# EasyEDA schematic SCH_Auto-Sensor-Home-Light_2025-07-21.json
TITLE: Sheet_1; REV: 1.0; Date: 2025-07-18; Sheet: 1/1; Company: Your Company
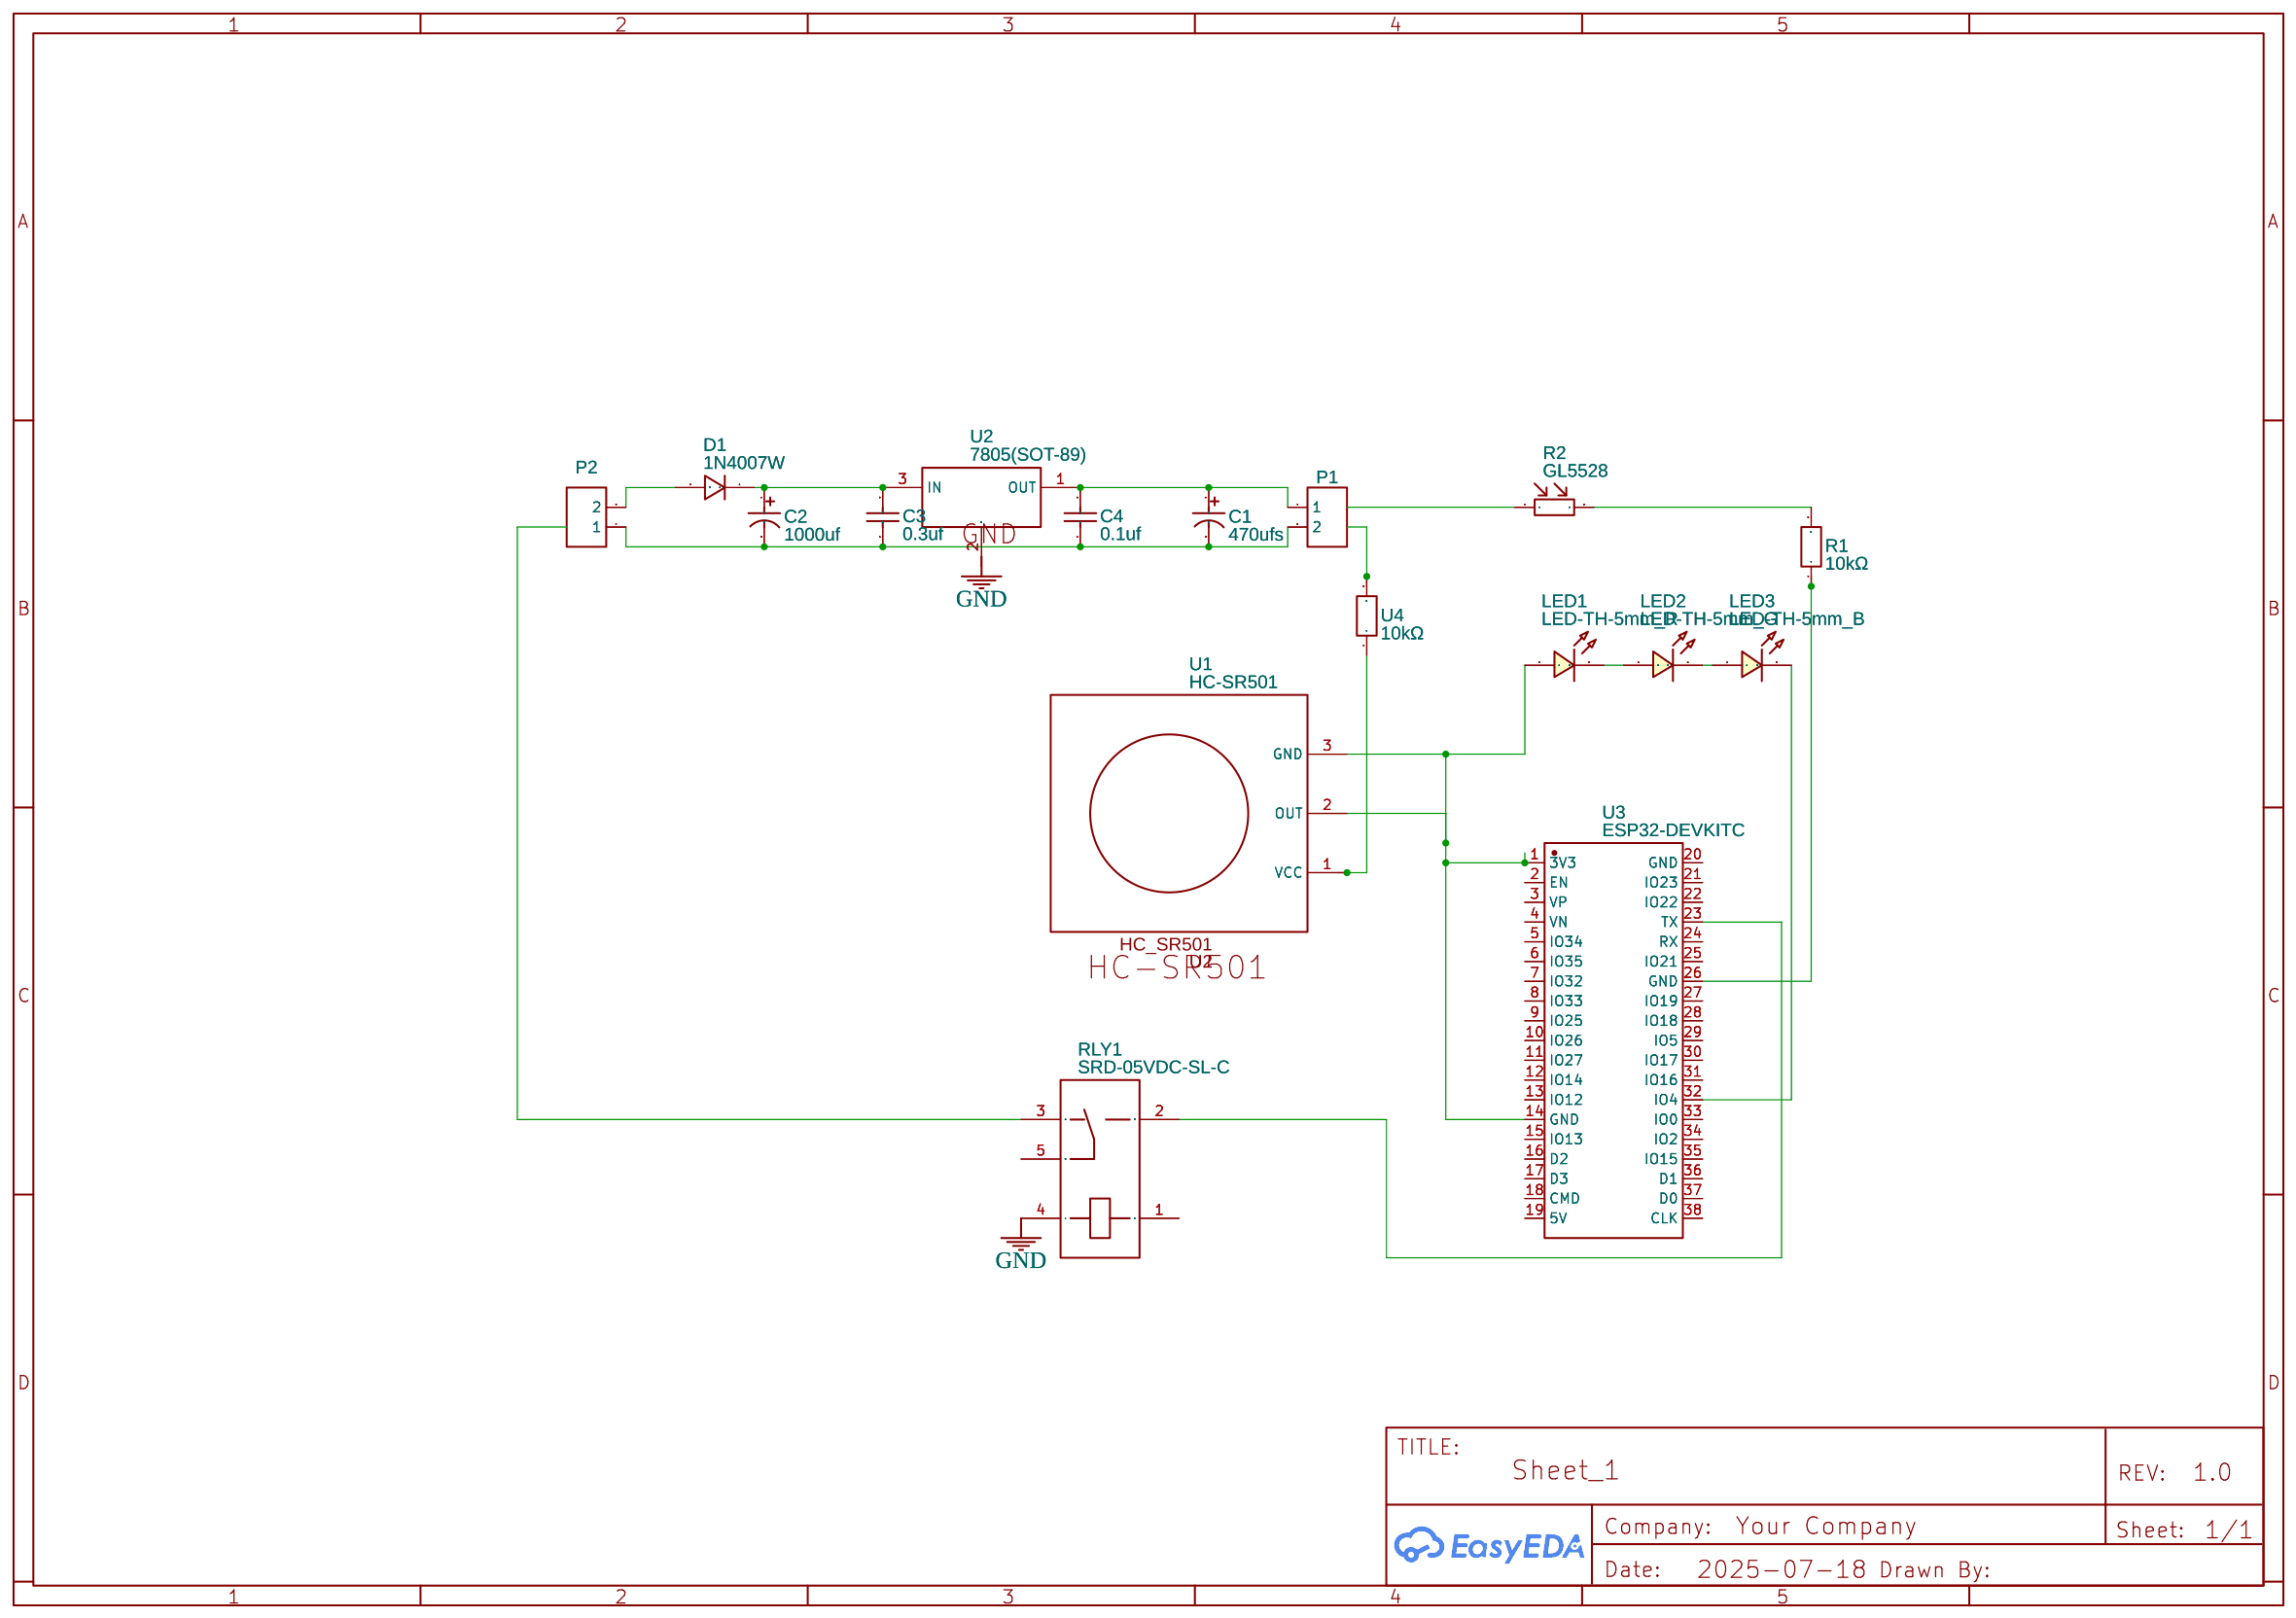
[diagram p0: schematic sheet]

## Parts
C1  470ufs  [CAP-TH_BD5.0-P2.00-D0.8-FD]
C2  1000uf  [CAP-TH_BD5.0-P2.00-D0.8-FD]
C3  0.3uf  [CAP-2.5*6*7]
C4  0.1uf  [CAP-2.5*6*7]
D1  1N4007W  [SOD-123_L2.8-W1.8-LS3.7-RD]
LED1  LED-TH-5mm_R  [LED-TH_BD5.0_RED]
LED2  LED-TH-5mm_G  [LED-TH_BD5.0_GREEN]
LED3  LED-TH-5mm_B  [LED-TH_BD5.0_BLUE]
P1  CONN-TH_2P-P5.00  [CONN-TH_2P-P5.00]
P2  CONN-TH_2P-P5.00  [CONN-TH_2P-P5.00]
R1  10kΩ  [RES-TH_BD6.4-L16.0-P20.00-D1.0]
R2  GL5528  [RES-TH_L5.1-W4.3-P3.40-D0.5]
RLY1  SRD-05VDC-SL-C  [RELAY-TH_SRD-XXVDC-XL-C]
U1  HC-SR501  [HC-SR501]
U2  7805(SOT-89)  [SOT-89-3_L4.5-W2.5-P1.50-LS4.2-BR]
U3  ESP32-DEVKITC  [BULETM-SMD_ESP32-DEVKITC]
U4  10kΩ  [R0603]

## Library data of the parts
C1 C2 = 10uF 16V 5*11: Supplier: LCSC; Manufacturer: CX(承兴); Manufacturer Part: KM106M016D11RR0VH2FP0; Supplier Part: C43799; JLCPCB Part Class: Extended Part
C3 C4 = 10nF(103) ±5% 100V: Supplier Part: undefined; Supplier: LCSC; Manufacturer: ReliaPro
D1 = 1N4007W: Supplier: LCSC; Supplier Part: C328592; Manufacturer: BLUE ROCKET; Contributor: LCEDA_Lib
LED1 = LED-TH-5mm_R: Manufacturer: EVERLIGHT(台湾亿光); Manufacturer Part: 333-2SURD/S530-A3; Supplier Part: C87271; Supplier: LCSC; Contributor: LCEDA_Lib
LED2 = LED-TH-5mm_G: Manufacturer: EVERLIGHT(台湾亿光); Manufacturer Part: 333-2SYGD/S530-E2; Supplier Part: C88163; Supplier: LCSC; Contributor: LCEDA_Lib
LED3 = LED-TH-5mm_B: Supplier: LCSC; Contributor: LCEDA_Lib
P1 P2 = CONN-TH_2P-P5.00: Supplier: LCSC; Contributor: LCEDA_Lib
R1 = B5J10K: Contributor: lcsc; Supplier: LCSC; Supplier Part: C3425392; Manufacturer: Ohmite; JLCPCB Part Class: Extended Part
R2 = GL5528: Supplier: LCSC; Manufacturer: 森霸; Supplier Part: C125627; JLCPCB Part Class: Extended Part
RLY1 = SRD-05VDC-SL-C: Supplier: LCSC; Manufacturer: 松乐; Supplier Part: C35449; JLCPCB Part Class: Extended Part
U1 = HC-SR501: Manufacturer: Generic; Supplier: Generic; Supplier Part: Generic HC-SR501; link: https://components101.com/sensors/hc-sr501-pir-sensor; Contributor: brosantai096
U2 = 7805(SOT-89): Supplier: LCSC; Manufacturer: CJ; Manufacturer Part: CJ78L05; image: //image.lceda.cn/szlcsc/C2079.jpg; Supplier Part: C2079; Paste Type: expand; Contributor: LCEDA_Lib
U3 = ESP32-DEVKITC: Supplier: LCSC; Supplier Part: C571180; Manufacturer: ESPRESSIF(乐鑫); Manufacturer Part: ESP32-DevKitC; Contributor: lcsc; JLCPCB Part Class: Extended Part
U4 = 0603 ±5% 10K: Supplier: LCSC; Supplier Part: C2889392; Manufacturer: VO(翔胜); JLCPCB Part Class: Extended Part; Contributor: lcsc

## Nets
GND: RLY1.4
Net-(C1-1): C1.1 C4.2 P1.1 U2.1(OUT)
Net-(C1-2): C1.2 C2.2 C3.1 C4.1 P1.2 P2.1
Net-(C2-1): C2.1 C3.2 D1.1 U2.3(IN)
Net-(D1-2): D1.2 P2.2
Net-(LED1-1): LED1.1 U1.2(OUT) U1.3(GND) U3.1(3V3) U3.14(GND)
Net-(LED1-2): LED1.2 LED2.1
Net-(LED2-2): LED2.2 LED3.1
Net-(LED3-2): LED3.2 U3.32(IO4)
Net-(R1-1): R1.1 U3.26(GND)
Net-(R1-2): R1.2 R2.2
Net-(RLY1-2): RLY1.2 U3.23(TX)
Net-(U1-1): U1.1(VCC) U4.1

Not connected (* = marked no-connect by the designer): R2 1; RLY1 1 3 5; U2 2(GND); U3 2(EN) 3(VP) 4(VN) 5(IO34) 6(IO35) 7(IO32) 8(IO33) 9(IO25) 10(IO26) 11(IO27) 12(IO14) 13(IO12) 15(IO13) 16(D2) 17(D3) 18(CMD) 19(5V) 20(GND) 21(IO23) 22(IO22) 24(RX) 25(IO21) 27(IO19) 28(IO18) 29(IO5) 30(IO17) 31(IO16) 33(IO0) 34(IO2) 35(IO15) 36(D1) 37(D0) 38(CLK); U4 2
